# Altium schematic sheet power.SchDoc
size A4
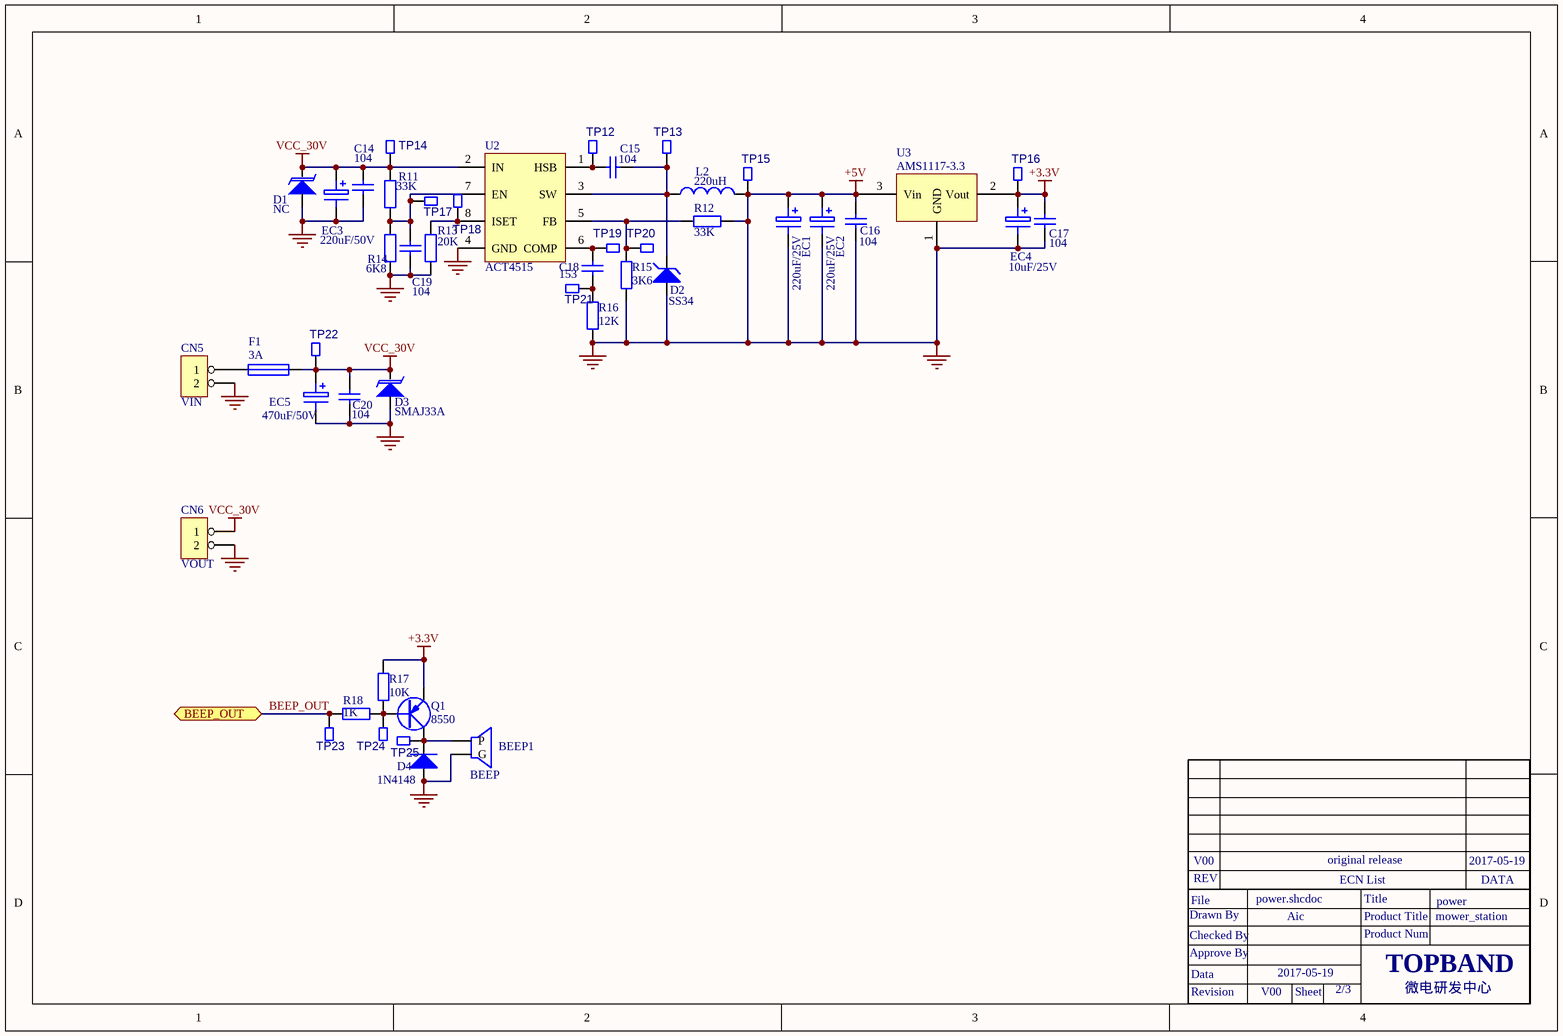
[diagram p0: power.SchDoc]

## Parts
BEEP1  BEEP  [BELL-5]
C14  104  [0603C]
C15  104  [0603C]
C16  104  [0603C]
C17  104  [0603C]
C18  153  [0603C]
C19  104  [0603C]
C20  104  [0805C]
CN5  VIN  [CON2-2.54]
CN6  VOUT  [CON2-2.54]
D1  NC  [SOD-123]
D2  SS34  [SMA]
D3  SMAJ33A  [DO-214AC]
D4  1N4148  [SOD-123]
EC1  220uF/25V  [EC10]
EC2  220uF/25V  [EC10]
EC3  220uF/50V  [EC10]
EC4  10uF/25V  [EC4]
EC5  470uF/50V  [EC12.5]
F1  3A  [0603]
L2  220uH  [150700618]
Q1  8550  [SOT-23-BCE]
R11  33K  [0603R]
R12  33K  [0603R]
R13  20K  [0603R]
R14  6K8  [0603R]
R15  3K6  [0603R]
R16  12K  [0603R]
R17  10K  [0603R]
R18  1K  [0603R]
TP12  TP  [TEST-0.8MM]  (value not drawn)
TP13  TP  [TEST-0.8MM]  (value not drawn)
TP14  TP  [TEST-0.8MM]  (value not drawn)
TP15  TP  [TEST-0.8MM]  (value not drawn)
TP16  TP  [TEST-0.8MM]  (value not drawn)
TP17  TP  [TEST-0.8MM]  (value not drawn)
TP18  TP  [TEST-0.8MM]  (value not drawn)
TP19  TP  [TEST-0.8MM]  (value not drawn)
TP20  TP  [TEST-0.8MM]  (value not drawn)
TP21  TP  [TEST-0.8MM]  (value not drawn)
TP22  TP  [TEST-0.8MM]  (value not drawn)
TP23  TP  [TEST-0.8MM]  (value not drawn)
TP24  TP  [TEST-0.8MM]  (value not drawn)
TP25  TP  [TEST-0.8MM]  (value not drawn)
U2  ACT4515  [SOP-8]
U3  AMS1117-3.3  [SOT-223]

## Ports
BEEP_OUT

## Nets
+3.3V: C17.1 EC4.1 Q1.E R17.2 TP16.1 U3.2(Vout)
+5V: BEEP1.2(G) C14.2 C16.1 C16.2 C17.2 C19.2 C20.1 CN5.2 CN6.2 D1.A D2.A D3.A D4.A EC1.1 EC1.2 EC2.1 EC2.2 EC3.2 EC4.2 EC5.2 L2.2 R12.1 R13.2 R14.2 R15.1 R16.1 TP15.1 U2.4(GND) U3.1(GND) U3.3(Vin)  [also labelled GND]
VCC_30V: C14.1 C20.2 CN6.1 D1.K D3.K EC3.1 EC5.1 F1.2 R11.1 TP14.1 TP22.1 U2.2(IN)
BEEP_OUT: R18.1 TP23.1 ; port BEEP_OUT
NetBEEP1_1: BEEP1.1(P) D4.K Q1.C TP25.1
NetC15_1: C15.1 TP12.1 U2.1(HSB)
NetC15_2: C15.2 D2.K L2.1 TP13.1 U2.3(SW)
NetC18_1: C18.1 TP19.1 U2.6(COMP)
NetC18_2: C18.2 R16.2 TP21.1
NetC19_1: C19.1 R11.2 R14.1 TP17.1 U2.7(EN)
NetCN5_1: CN5.1 F1.1
NetQ1_B: Q1.B R17.1 R18.2 TP24.1
NetR12_2: R12.2 R15.2 TP20.1 U2.5(FB)
NetR13_1: R13.1 TP18.1 U2.8(ISET)

## Notes on the sheet
- Drawn By
- File
- REV
- V00
- power.shcdoc
- Aic
- original release
- ECN List
- Product Title
- Title
- mower_station
- power
- 2017-05-19
- DATA
- Approve By
- Checked By
- Data
- Product Num
- TOPBAND
- Revision
- Sheet
- 2/3
- 微电研发中心

## Library data of the parts
C14-C20 = Cap(0603): Component Kind: standard; Component Type: standard
CN5 CN6 = 2Pin(卧式): 插座; U_TABLE: U_SAM01021601; id: 20; Part Number: 2Pin(卧式); Component Kind: Standard; Component Type: Standard; Designator: 2Pin(卧式); Footprint: CON2-2.54卧式; Pin Count: 2
D1 = Diode(TVS_贴片)_1: TVS管; U_TABLE: U_SAM010203; id: 28; Part Number: Diode(TVS_贴片)_1; Component Kind: standard; Component Type: standard; Pin Count: 2
D2 = D Zener(贴片): 120301465; U_TABLE: U_SAM010203; id: 25; Description: 稳压二极管; Part Number: D Zener(贴片); Component Kind: standard; Component Type: standard; Pin Count: 2
D3 = Diode(TVS_贴片)_1: 120301346; U_TABLE: U_SAM010203; id: 28; Description: TVS管; Part Number: Diode(TVS_贴片)_1; Component Kind: standard; Component Type: standard; Pin Count: 2
D4 = Diode(DO-35)-D: 二极管; U_TABLE: U_SAM010203; id: 32; Part Number: Diode(DO-35)-D; Component Kind: standard; Component Type: standard; Pin Count: 2
EC1-EC4 = Electro(2.5mm): 电解电容; U_TABLE: U_SAM010202; id: 42; Part Number: Electro(2.5mm); Component Kind: standard; Component Type: standard; Pin Count: 2
EC5 = Electro(2.5mm): 150200079; U_TABLE: U_SAM010202; id: 42; Description: 电解电容; Part Number: Electro(2.5mm); Component Kind: standard; Component Type: standard; Pin Count: 2
F1 = Fuse(1206): 121100112; U_TABLE: U_SAM010211; id: 119; Description: 保险管; Part Number: Fuse(1206); Component Kind: standard; Component Type: standard
L2 = Inductor(0805): 150700618; U_TABLE: U_SAM010207; id: 140; Description: 电感; Part Number: Inductor(0805); Component Kind: standard; Component Type: standard
Q1 = PNP(贴片): 三极管; U_TABLE: U_SAM010204; id: 20; Part Number: PNP(贴片); Component Kind: standard; Component Type: standard; Pin Count: 3
R11-R16 = Res2: Resistor; Value: 1K; 物料编码: 150103083; Published: 8-Jun-2000; LatestRevisionDate: 17-Jul-2002; LatestRevisionNote: Re-released for DXP Platform.; PackageReference: AXIAL-0.4; Publisher: Altium Limited
R17 R18 = Res(0603): 120100221; U_TABLE: U_SAM010201; id: 106; Description: 电阻器; U_ITEM_ID（物料编码）: 120101813; U_100114（SAP物料描述）: SMT电阻RR0603_1502_F_1/16W_50V_国巨_; U_100012（标称值-文本）: 1502; U_100116（标称值-浮点）: 15; U_100013（单位）: KΩ; U_100083（允许偏差）: F; U_100029（额定功率）: 1/16W; U_100040（封装方式）: RR0603; U_100049（极限电压）: 50V; U_100047（环保属性）: 环保; U_100107（工厂BOM使用频率）: 2000:8;; U_100105（工厂库存）: 1200:0.000;2000:3965.000;3000:0.000;; U_100117（工厂采购量）: 2000:5000.000;; Part Number: Res(0603); Component Kind: standard; Component Type: standard; U_100086（指定供应商）: 国巨